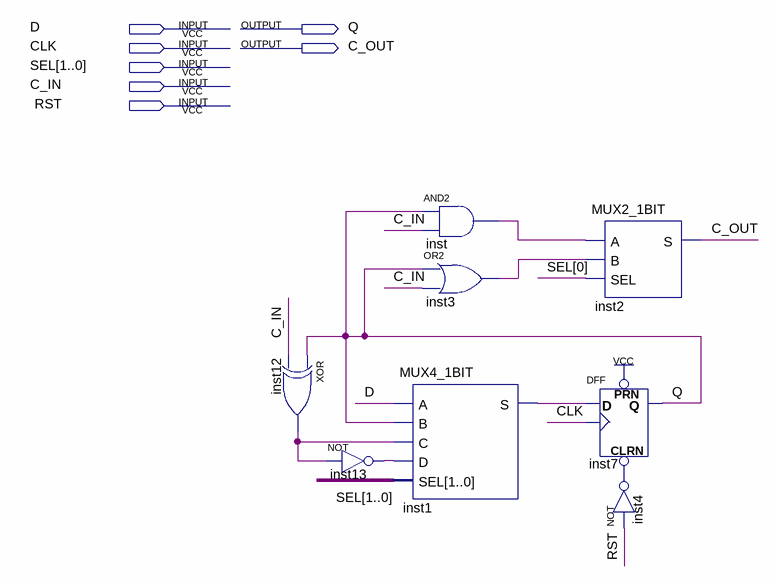
[diagram p0: schematic sheet]
// Quartus schematic UD_COUNTER_1BIT.bdf as structural Verilog: 8 symbols, 7 pins
module UD_COUNTER_1BIT (
  input  D,
  input  CLK,
  input  [1:0] SEL,
  input  C_IN,
  input  RST,
  output Q,
  output C_OUT
);

  wire inst1_s, inst3_out, inst4_out, inst12_out, inst13_out, inst_out;

  xor inst12 (inst12_out, Q, C_IN);
  not inst13 (inst13_out, inst12_out);
  and inst (inst_out, Q, C_IN);
  or inst3 (inst3_out, Q, C_IN);
  MUX4_1BIT inst1 (.A(D), .B(Q), .C(inst12_out), .D(inst13_out), .SEL(SEL), .S(inst1_s));
  MUX2_1BIT inst2 (.A(inst_out), .B(inst3_out), .SEL(SEL[0]), .S(C_OUT));
  DFF inst7 (.CLRN(inst4_out), .CLK(CLK), .D(inst1_s), .PRN(1'b1), .Q(Q));
  not inst4 (inst4_out, RST);
endmodule
